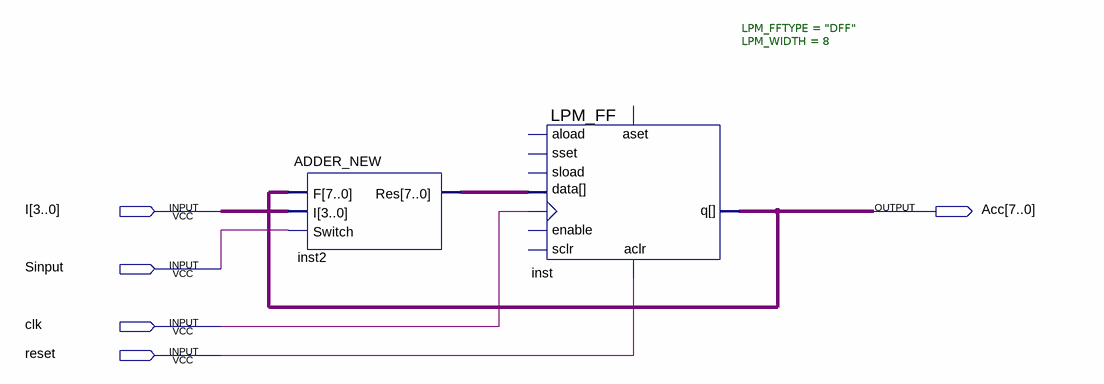
[diagram p0: schematic sheet]
// Quartus schematic Accumulator.bdf as structural Verilog: 2 symbols, 5 pins
module Accumulator (
  input  [3:0] I,
  input  Sinput,
  input  clk,
  input  reset,
  output [7:0] Acc
);

  wire [7:0] inst2_res;

  ADDER_NEW inst2 (.F(Acc), .I(I), .Switch(Sinput), .Res(inst2_res));
  LPM_FF #(.LPM_FFTYPE("DFF"), .LPM_WIDTH(8)) inst (
    .clock(clk), .aclr(reset), .data(inst2_res), .q(Acc));  // open: enable, aload, sset, sload, aset, sclr
endmodule
